# EasyEDA Pro project EFT_X003_Y003_X007_2.eprj

# Schematic Schematic1
Create Date: 2023-04-26; Page Name: P1; Project Name: EFT_X003_Y003_X007_2; Schematic Name: Schematic1; Update Date: 2023-05-25; Company: 嘉立创EDA; Page Size: A4; Version: V1.0
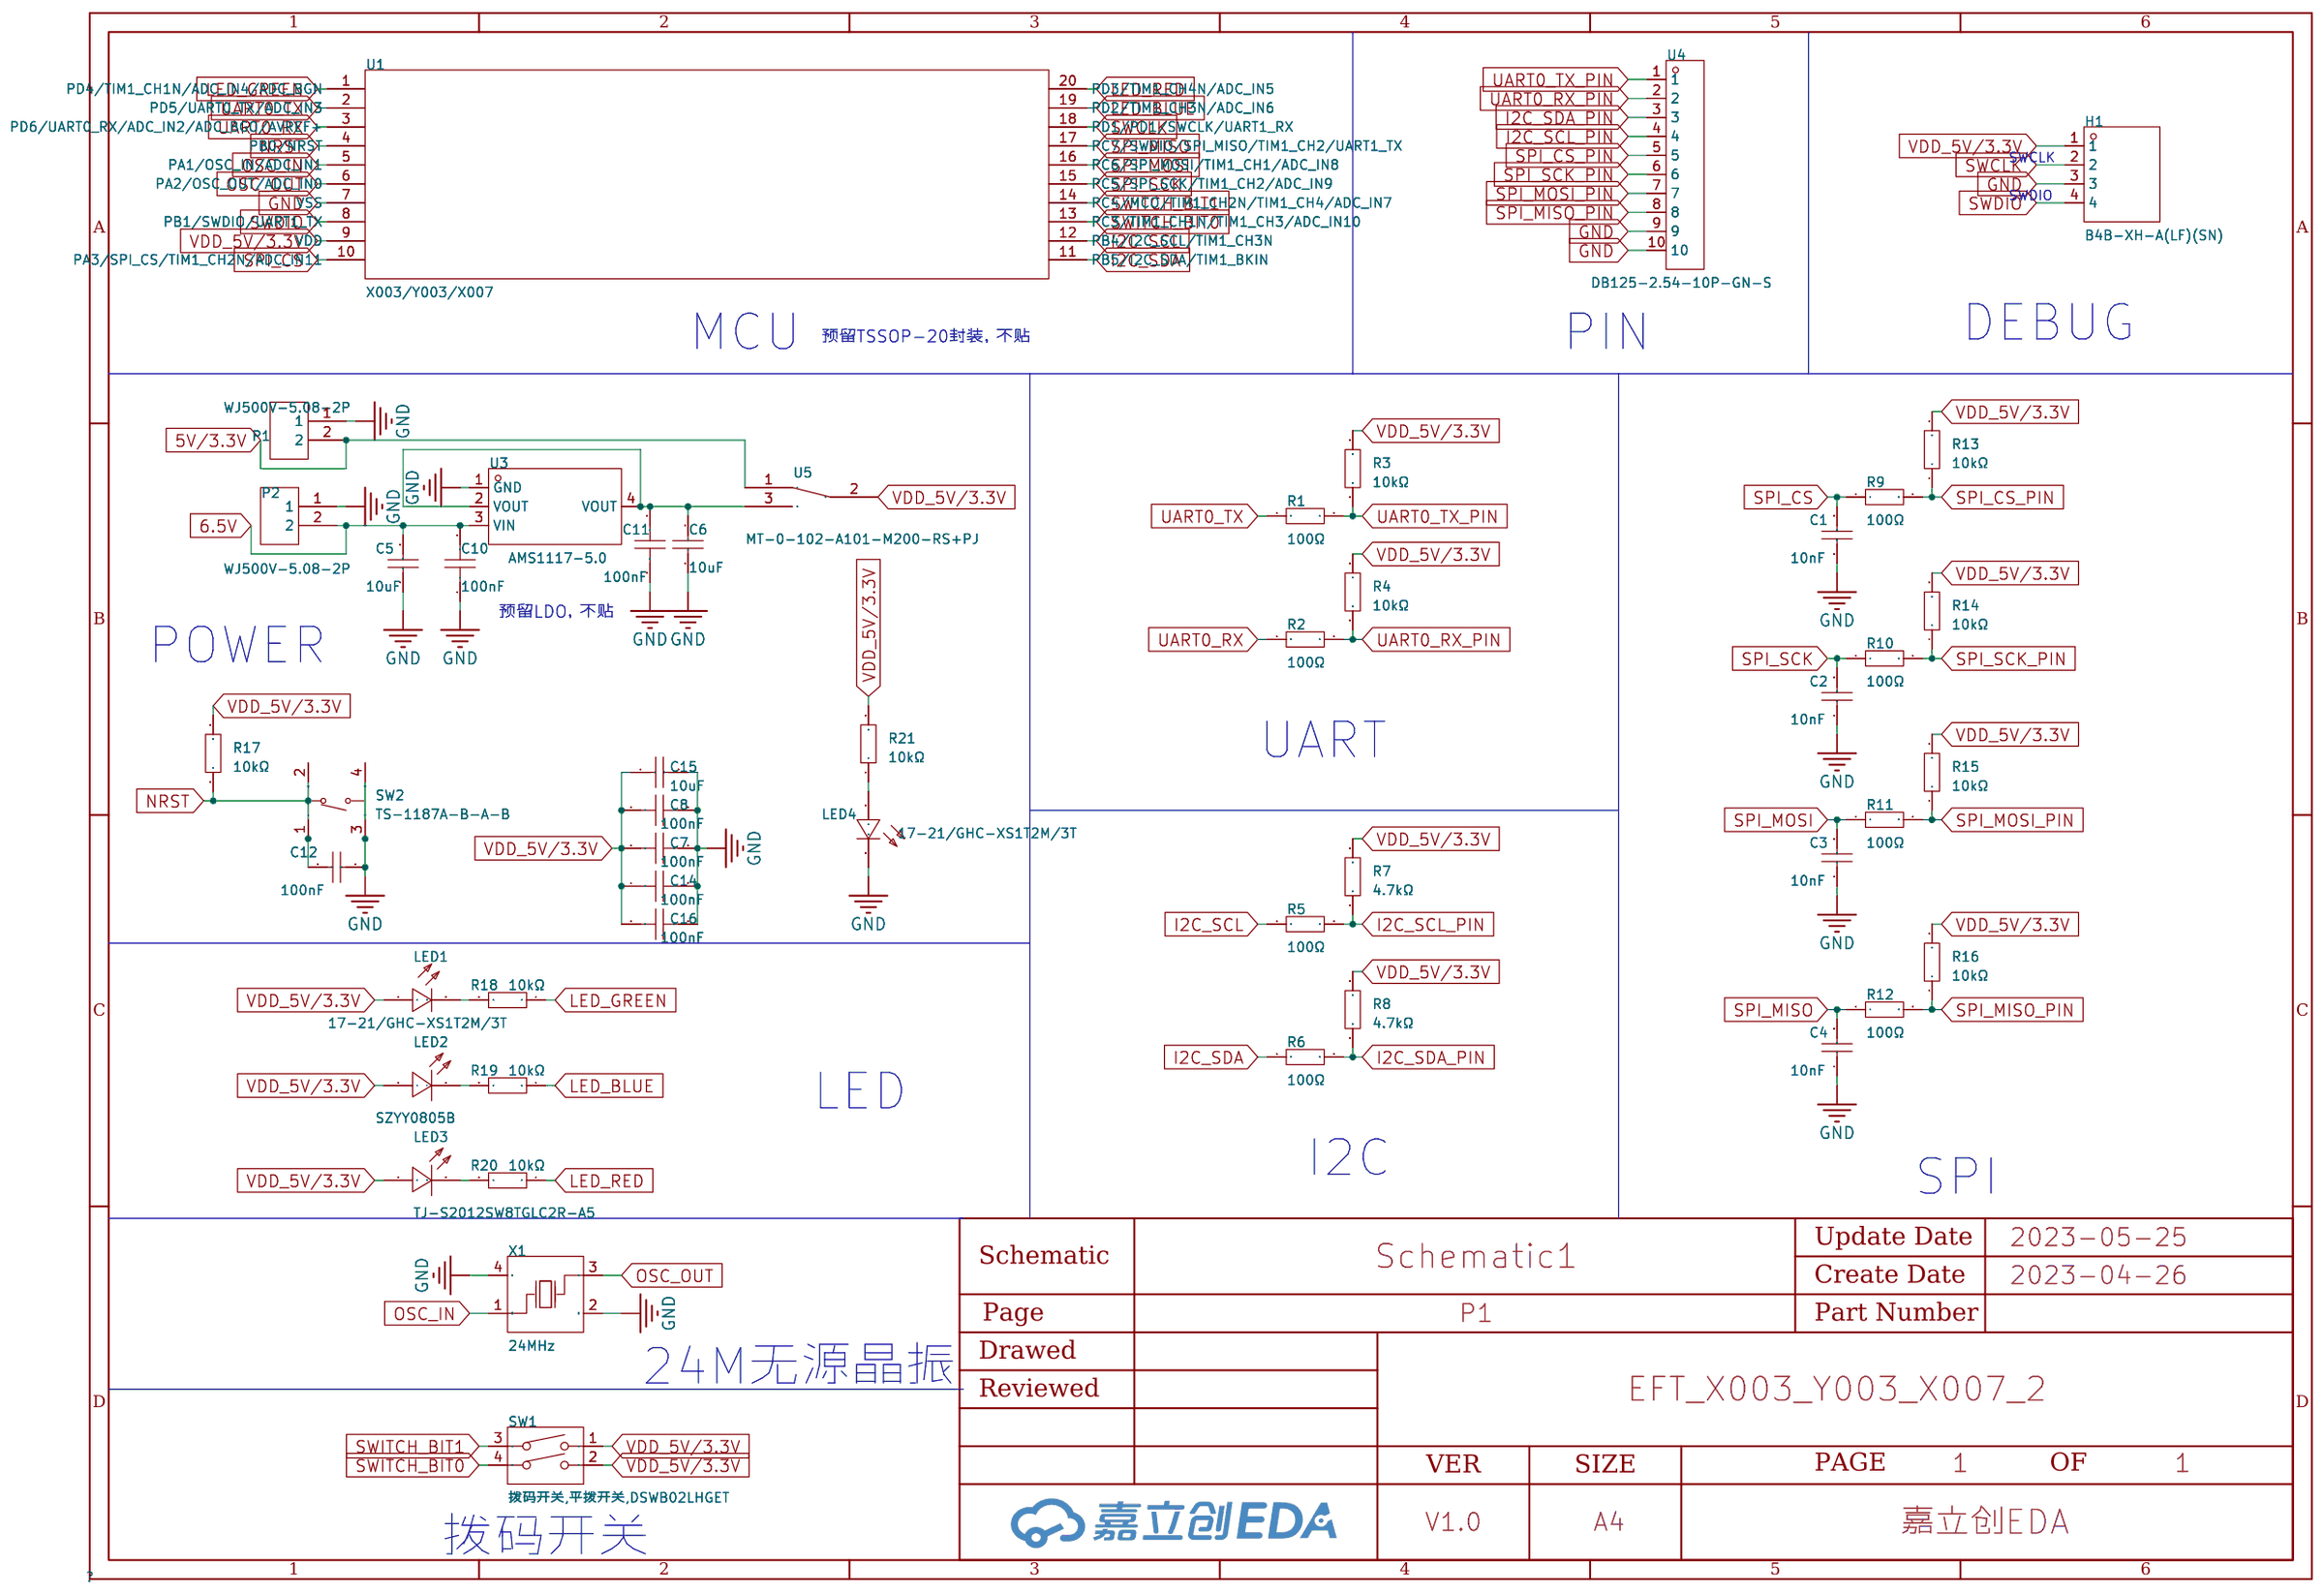
[diagram p0: schematic sheet]

## Parts
C1  10nF  [C0805]
C2  10nF  [C0805]
C3  10nF  [C0805]
C4  10nF  [C0805]
C5  10uF  [C0805]
C6  10uF  [C0805]
C7  100nF  [C0603]
C8  100nF  [C0603]
C10  100nF  [C0603]
C11  100nF  [C0603]
C12  100nF  [C0603]
C14  100nF  [C0603]
C15  10uF  [C0805]
C16  100nF  [C0603]
H1  B4B-XH-A(LF)(SN)  [CONN-TH_B4B-XH-A-LF-SN]
LED1  17-21/GHC-XS1T2M/3T  [LED0805-R-RD]
LED2  SZYY0805B  [LED0805-R-RD_BLUE]
LED3  TJ-S2012SW8TGLC2R-A5  [LED0805-R-RD]
LED4  17-21/GHC-XS1T2M/3T  [LED0805-R-RD]
P1  WJ500V-5.08-2P  [CONN-TH_2P-P5.00_WJ500V-5.08-2P]
P2  WJ500V-5.08-2P  [CONN-TH_2P-P5.00_WJ500V-5.08-2P]
R1  100Ω  [R0805]
R2  100Ω  [R0805]
R3  10kΩ  [R0805]
R4  10kΩ  [R0805]
R5  100Ω  [R0805]
R6  100Ω  [R0805]
R7  4.7kΩ  [R0805]
R8  4.7kΩ  [R0805]
R9  100Ω  [R0805]
R10  100Ω  [R0805]
R11  100Ω  [R0805]
R12  100Ω  [R0805]
R13  10kΩ  [R0805]
R14  10kΩ  [R0805]
R15  10kΩ  [R0805]
R16  10kΩ  [R0805]
R17  10kΩ  [R0805]
R18  10kΩ  [R0805]
R19  10kΩ  [R0805]
R20  10kΩ  [R0805]
R21  10kΩ  [R0805]
SW1  拨码开关,平拨开关,DSWB02LHGET  [SW-TH_DSWB02LHGET]
SW2  TS-1187A-B-A-B  [SW-SMD_4P-L5.1-W5.1-P3.70-LS6.5-TL-2]
U1  X003/Y003/X007  [TSSOP-20_L6.5-W4.4-P0.65-LS6.4-BL]
U3  AMS1117-5.0  [SOT-223_L6.5-W3.5-P2.30-LS7.0-BR]
U4  DB125-2.54-10P-GN-S  [CONN-TH_DB125-2.54-10P-GN]
U5  MT-0-102-A101-M200-RS+PJ  [SW-TH_MT-0-103-A101-M200-RS]
X1  24MHz  [CRYSTAL-SMD_4P-L3.2-W2.5-BL]

## Library data of the parts
C1-C4 = CL21B103KBANNNC: 容值:10nF;精度:±10%;额定电压:50V;材质(温度系数):X7R;; LCSC Part Name: 10nF ±10% 50V; Supplier Part: C1710; Manufacturer: SAMSUNG(三星); Supplier Footprint: 0805; JLCPCB Part Class: Basic Part; Datasheet: https://atta.szlcsc.com/upload/public/pdf/source/20160103/1457707693082.pdf; Supplier: LCSC; Tolerance: ±10%; Voltage Rated: 50V; Temperature Coefficient: X7R
C5 C6 C15 = CL21A106KAYNNNE_C15850: 容值:10uF;精度:±10%;额定电压:25V;材质(温度系数):X5R;; LCSC Part Name: 10uF ±10% 25V; Supplier Part: C15850; Manufacturer: SAMSUNG(三星); Manufacturer Part: CL21A106KAYNNNE; Supplier Footprint: 0805; JLCPCB Part Class: Basic Part; Datasheet: https://atta.szlcsc.com/upload/public/pdf/source/20160103/1457707679302.pdf; Supplier: LCSC; Tolerance: ±10%; Voltage Rated: 25V; Temperature Coefficient: X5R
C7 C8 C14 C16 = CC0603KRX7R9BB104: 容值:100nF;精度:±10%;额定电压:50V;材质(温度系数):X7R;; LCSC Part Name: 100nF ±10% 50V; Supplier Part: C14663; Manufacturer: YAGEO(国巨); Supplier Footprint: 0603; JLCPCB Part Class: Basic Part; Datasheet: https://atta.szlcsc.com/upload/public/pdf/source/20180910/C282072_33301C7F631E79921B82A8DAC6BCC5B3.pdf; Supplier: LCSC; Tolerance: ±10%; Voltage Rated: 50V; Temperature Coefficient: X7R
C10 C11 = CL10B104KB8NNNC: 容值:100nF;精度:±10%;额定电压:50V;材质(温度系数):X7R;; LCSC Part Name: 100nF ±10% 50V; Supplier Part: C1591; Manufacturer: SAMSUNG(三星); Supplier Footprint: 0603; JLCPCB Part Class: Extended Part; Datasheet: https://atta.szlcsc.com/upload/public/pdf/source/20160103/1457707680512.pdf; Supplier: LCSC; Tolerance: ±10%; Voltage Rated: 50V; Temperature Coefficient: X7R
C12 = 0603B104K500NT: 容值:100nF;精度:±10%;额定电压:50V;材质(温度系数):X7R;; LCSC Part Name: 100nF ±10% 50V; Supplier Part: C30926; Manufacturer: FH(风华); Supplier Footprint: 0603; JLCPCB Part Class: Extended Part; Datasheet: https://atta.szlcsc.com/upload/public/pdf/source/20170923/C30926_1506149436298988724.pdf; Supplier: LCSC; Tolerance: ±10%; Voltage Rated: 50V; Temperature Coefficient: X7R
H1 = B4B-XH-A(LF)(SN): 参考系列:XH;间距:2.5mm;插针结构:1x4P;排数:1;每排PIN数:4;行距:-;安装方式:-;触头材质:黄铜;; LCSC Part Name: XH 2.5mm 1x4P; Supplier Part: C144395; Manufacturer: JST; Supplier Footprint: 插件,P=2.5mm; JLCPCB Part Class: Extended Part; Datasheet: https://atta.szlcsc.com/upload/public/pdf/source/20180327/C144395_D58F0D17A3F58B29FECD1B7D0A791262.pdf; Supplier: LCSC; Reference Series: XH; Pitch: 2.5mm; Pins Structure: 1x4P; Number of Rows: 1; Number of PINs Per Row: 4; Contact Material: 黄铜
LED1 LED4 = 17-21/GHC-XS1T2M/3T: 发光颜色:翠绿;二极管配置:-;主波长:515nm~530nm;色温:-;功率:75mW;安装方式:-;; LCSC Part Name: 翠绿; Supplier Part: C63855; Manufacturer: EVERLIGHT(亿光); Supplier Footprint: 0805; JLCPCB Part Class: Extended Part; Datasheet: https://atta.szlcsc.com/upload/public/pdf/source/20151222/1457707652176.pdf; Supplier: LCSC; Emitted Color: 翠绿; Lens Color: 无色透明; Dominant Wavelength: 515nm~530nm; Peak Wavelength: 518nm; Forward Current: 20mA; Power Dissipation: 75mW; Viewing Angle: 140°; Operating Temperature: -40℃~+85℃
LED2 = SZYY0805B: 发光颜色:蓝灯;二极管配置:-;主波长:460nm~475nm;色温:-;功率:100mW;安装方式:-;; LCSC Part Name: 蓝灯; Supplier Part: C434433; Manufacturer: yongyu(永裕光电); Supplier Footprint: 0805; JLCPCB Part Class: Extended Part; Datasheet: https://atta.szlcsc.com/upload/public/pdf/source/20191204/C434433_0B90CAB876449C52BDD12D5E48F83BBD.pdf; Supplier: LCSC; Emitted Color: 蓝灯; Lens Color: 无色透明; Dominant Wavelength: 460nm~475nm; Peak Wavelength: 469nm; Forward Current: 5mA; Power Dissipation: 100mW; Viewing Angle: 120°; Operating Temperature: -40℃~+85℃
LED3 = TJ-S2012SW8TGLC2R-A5: 发光颜色:红灯;二极管配置:-;主波长:620nm;色温:-;功率:72mW;安装方式:-;; LCSC Part Name: 红灯; Supplier Part: C192318; Manufacturer: TOGIALED(统佳); Supplier Footprint: 0805; JLCPCB Part Class: Extended Part; Datasheet: https://atta.szlcsc.com/upload/public/pdf/source/20180531/C192318_B0850358C40B41819ED2D84BD318C419.pdf; Supplier: LCSC; Emitted Color: 红灯; Lens Color: 无色透明; Dominant Wavelength: 620nm; Peak Wavelength: 635nm; Forward Current: 20mA; Power Dissipation: 72mW; Viewing Angle: 120°; Operating Temperature: -40℃~+80℃
P1 P2 = WJ500V-5.08-2P: 间距:5.08mm;结构:1x2P;排数:1;每排PIN数:2;安装方式:直针;额定电流:18A;额定电压:250V;线规 - AWG:14~30;线规 - mm2:2.5;工作温度范围:-40℃~+105℃;颜色:绿色;; LCSC Part Name: 5.08mm 1x2P 排数:1 每排P数:2 直针 可拼接; Supplier Part: C8465; Manufacturer: KANGNEX(康奈克斯电气); Supplier Footprint: 插件,P=5.08mm; JLCPCB Part Class: Extended Part; Datasheet: https://atta.szlcsc.com/upload/public/pdf/source/20191225/C8465_02D34CE5B5B4A53DF5891601D97FA9F4.pdf; Supplier: LCSC; Pitch: 5.08mm; Structure: 1x2P; Number of Rows: 1; Number of PINs Per Row: 2; Mounting Style: 直针; Current Rating (Max): 18A; Voltage Rating (Max): 250V; Wire Gauge - AWG: 14~30; Wire Gauge - mm2: 2.5; Operating Temperature Range: -40℃~+105℃; Color: 绿色
R1 R2 R5 R6 R9-R12 = 0805W8F1000T5E: 电阻类型:厚膜电阻;阻值:100Ω;精度:±1%;功率:125mW;; LCSC Part Name: 100Ω ±1% 125mW; Supplier Part: C17408; Manufacturer: UNI-ROYAL(厚声); Supplier Footprint: 0805; JLCPCB Part Class: Basic Part; Datasheet: https://atta.szlcsc.com/upload/public/pdf/source/20200306/C422600_1E6D84923E4A46A82E41ADD87F860B5C.pdf; Supplier: LCSC; Type: 厚膜电阻; Tolerance: ±1%; Power(Watts): 125mW; Temperature Coefficient: ±100ppm/℃; Overload Voltage (Max): 150V; Operating Temperature Range: -55℃~+155℃
R3 R4 R13-R16 = 0805W8F1002T5E_C17414: 电阻类型:厚膜电阻;阻值:10kΩ;精度:±1%;功率:125mW;; LCSC Part Name: 10kΩ ±1% 125mW; Supplier Part: C17414; Manufacturer: UNI-ROYAL(厚声); Manufacturer Part: 0805W8F1002T5E; Supplier Footprint: 0805; JLCPCB Part Class: Basic Part; Datasheet: https://atta.szlcsc.com/upload/public/pdf/source/20200306/C422600_1E6D84923E4A46A82E41ADD87F860B5C.pdf; Supplier: LCSC; Type: 厚膜电阻; Tolerance: ±1%; Power(Watts): 125mW; Temperature Coefficient: ±100ppm/℃; Overload Voltage (Max): 150V; Operating Temperature Range: -55℃~+155℃
R7 R8 = 0805W8F4701T5E: 电阻类型:厚膜电阻;阻值:4.7kΩ;精度:±1%;功率:125mW;; LCSC Part Name: 4.7kΩ ±1% 125mW; Supplier Part: C17673; Manufacturer: UNI-ROYAL(厚声); Supplier Footprint: 0805; JLCPCB Part Class: Basic Part; Datasheet: https://atta.szlcsc.com/upload/public/pdf/source/20200306/C422600_1E6D84923E4A46A82E41ADD87F860B5C.pdf; Supplier: LCSC; Type: 厚膜电阻; Tolerance: ±1%; Power(Watts): 125mW; Temperature Coefficient: ±100ppm/℃; Overload Voltage (Max): 150V; Operating Temperature Range: -55℃~+155℃
R17-R21 = RC0805FR-0710KL: 阻值:10kΩ;精度:±1%;功率:125mW;温度系数:±100ppm/℃;最大工作电压:150V;工作温度范围:-55℃~+155℃;; LCSC Part Name: 10kΩ ±1% 125mW; Supplier Part: C84376; Manufacturer: YAGEO(国巨); Supplier Footprint: 0805; JLCPCB Part Class: Extended Part; Datasheet: https://atta.szlcsc.com/upload/public/pdf/source/20170412/1491969112878.pdf; Supplier: LCSC; Tolerance: ±1%; Power(Watts): 125mW; Temperature Coefficient: ±100ppm/℃; Overload Voltage (Max): 150V; Operating Temperature Range: -55℃~+155℃
SW1 = 拨码开关,平拨开关,DSWB02LHGET: 类型:平拨，凸起式;电路结构:单刀单掷;开关位数:2;引脚间距:2.54mm;颜色:红色;; Supplier Part: C99421; Manufacturer: YE; Supplier Footprint: 插件; JLCPCB Part Class: Extended Part; Datasheet: https://atta.szlcsc.com/upload/public/pdf/source/20170330/1490854270511.pdf; Supplier: LCSC; Type: 平拨，凸起式; Circuit: 单刀单掷; Number of Positions: 2; Lead Pitch: 2.54mm; Color: 红色
SW2 = TS-1187A-B-A-B: 触点电流:50mA;额定电压(DC):12V;绝缘电阻:-;电路结构:单刀单掷;安装方式:立贴;带灯:无;作用力:160gf;机械寿命:10万次;带支架:否;; LCSC Part Name: 5.1*5.1*1.5mm 立贴 轻触开关 防水金属头; Supplier Part: C318884; Manufacturer: XKB Connectivity(中国星坤); Supplier Footprint: SMD; JLCPCB Part Class: Basic Part; Datasheet: https://atta.szlcsc.com/upload/public/pdf/source/20200227/C318884_1F20165719E1C4CAA3E10C4C359C6E26.pdf; Supplier: LCSC; Contact Current: 50mA; Voltage Rating (DC): 12V; Circuit: 单刀单掷; Mounting Style: 立贴; Actuator Style: 圆形按钮; Actuator/Cap Color: 金色; With Lamp: 无; Operating Force: 160gf; Mechanical Life: 10万次; Operating Temperature: -30℃~+85℃; Switch Length: 5.1mm; Switch Width: 5.1mm; Switch Height: 1.5mm; Strike Gundam: 否
U1 = PT32Y003
U3 = AMS1117-5.0_C6187: 输出类型:固定;输出极性:正;最大输入电压:15V;输出电压:5V;输出电流:1A;电源纹波抑制比(PSRR):68dB@(120Hz);; Supplier Part: C6187; Manufacturer: AMS; Supplier Footprint: SOT-223; JLCPCB Part Class: Basic Part; Datasheet: https://atta.szlcsc.com/upload/public/pdf/source/20180727/C6186_7A095716F0823C02F1997A905E26C086.pdf; Supplier: LCSC; Output Type: 固定; Output Polarity: 正; Number of Outputs: 1; Maximum Input Voltage: 15V; Output Voltage: 5V; Dropout Voltage: 1.3V@(1A); Output Current: 1A; Power Supply Rejection Ratio (PSRR): 68dB@(120Hz)
U4 = DB125-2.54-10P-GN-S: 间距:2.54mm;结构:1x10P;排数:1;每排PIN数:10;安装方式:直针;额定电流:8A;额定电压:130V;线规 - AWG:18~26;线规 - mm2:0.5~1;工作温度范围:-40℃~+105℃;颜色:绿色;; LCSC Part Name: 2.54mm 1x10P 排数:1 每排P数:10 直针; Supplier Part: C918128; Manufacturer: DIBO(地博电气); Supplier Footprint: 插件,P=2.54mm; JLCPCB Part Class: Extended Part; Datasheet: https://atta.szlcsc.com/upload/public/pdf/source/20230106/BCD3A0BE1EB95DC3E813F1745F022035.pdf; Supplier: LCSC; Pitch: 2.54mm; Structure: 1x10P; Number of Rows: 1; Number of PINs Per Row: 10; Mounting Style: 直针; Current Rating (Max): 8A; Voltage Rating (Max): 130V; Wire Gauge - AWG: 18~26; Wire Gauge - mm2: 0.5~1; Operating Temperature Range: -40℃~+105℃; Color: 绿色
U5 = MT-0-102-A101-M200-RS+PJ: 额定电流:5A;额定电压(AC):125V;电路结构:单刀双掷;机械寿命:-;安装方式:直插;; LCSC Part Name: 小型钮子三脚二档(五件套); Supplier Part: C1788492; Manufacturer: YUEN FUNG(源丰); Supplier Footprint: 插件; JLCPCB Part Class: Extended Part; Datasheet: https://atta.szlcsc.com/upload/public/pdf/source/20201225/C1788492_A57BE75F5111615E295075D92E39ECB7.pdf; Supplier: LCSC; Contact Current: 5A; Voltage Rating (AC): 125V; Circuit: 单刀双掷; Actuator Type: 圆柱钮柄; Pin Style: 焊片; Mounting Style: 直插; Operating Temperature: -25℃~+85℃; Switch Length: 13mm; Switch Width: 8mm; Switch Height: 28.6mm
X1 = 3S24000333: 频率:24MHz;频率公差:±10ppm;频率稳定度:±50ppm;负载电容:8pF;; LCSC Part Name: 24MHz ±10ppm 8pF; Supplier Part: C427553; Manufacturer: YL(惠伦晶体); Supplier Footprint: SMD3225-4P; JLCPCB Part Class: Extended Part; Datasheet: https://atta.szlcsc.com/upload/public/pdf/source/20190911/C427553_A09B0D9076107BB8EFDFC7C7D2192982.pdf; Supplier: LCSC; Crystal Type: 贴片无源晶振; Frequency Tolerance: ±10ppm; Frequency Stability: ±50ppm; Load Capacitance: 8pF; Equivalent Series Resistance (ESR): 50Ω; Operating Temperature: -40℃~+125℃

## Nets
5V/3.3V: P1.2 U5.1
6.5V: C5.2 C10.2 P2.2 U3.3(VIN)
GND: C1.1 C2.1 C3.1 C4.1 C5.1 C6.1 C7.2 C8.2 C10.1 C11.1 C12.2 C14.2 C15.2 C16.2 H1.3 LED4.2(C) P1.1 P2.1 SW2.3(C) SW2.4(D) U1.7(VSS) U3.1(GND) U4.9 U4.10 X1.2(GND) X1.4(GND)
VDD_5V/3.3V: C7.1 C8.1 C14.1 C15.1 C16.1 H1.1 LED1.1(A) LED2.1(+) LED3.1(A) R3.2 R4.1 R7.2 R8.2 R13.2 R14.2 R15.2 R16.2 R17.2 R21.2 SW1.1 SW1.2 U1.9(VDD) U5.2
I2C_SCL: R5.1 U1.12(PB4/I2C_SCL/TIM1_CH3N)
I2C_SCL_PIN: R5.2 R7.1 U4.4
I2C_SDA: R6.1 U1.11(PB5/I2C_SDA/TIM1_BKIN)
I2C_SDA_PIN: R6.2 R8.1 U4.3
LED_BLUE: R19.1 U1.19(PD2/TIM1_CH3N/ADC_IN6)
LED_GREEN: R18.1 U1.1(PD4/TIM1_CH1N/ADC_IN4/ADC_BGN)
LED_RED: R20.1 U1.20(PD3/TIM1_CH4N/ADC_IN5)
NRST: C12.1 R17.1 SW2.1(A) SW2.2(B) U1.4(PB0/NRST)
OSC_IN: U1.5(PA1/OSC_IN/ADC_IN1) X1.1(OSC1)
OSC_OUT: U1.6(PA2/OSC_OUT/ADC_IN0) X1.3(OSC2)
SPI_CS: C1.2 R9.1 U1.10(PA3/SPI_CS/TIM1_CH2N/ADC_IN11)
SPI_CS_PIN: R9.2 R13.1 U4.5
SPI_MISO: C4.2 R12.1 U1.17(PC7/SWDIO/SPI_MISO/TIM1_CH2/UART1_TX)
SPI_MISO_PIN: R12.2 R16.1 U4.8
SPI_MOSI: C3.2 R11.1 U1.16(PC6/SPI_MOSI/TIM1_CH1/ADC_IN8)
SPI_MOSI_PIN: R11.2 R15.1 U4.7
SPI_SCK: C2.2 R10.1 U1.15(PC5/SPI_SCK/TIM1_CH2/ADC_IN9)
SPI_SCK_PIN: R10.2 R14.1 U4.6
SWCLK: H1.2 U1.18(PD1/PD1/SWCLK/UART1_RX)
SWDIO: H1.4 U1.8(PB1/SWDIO/UART1_TX)
SWITCH_BIT0: SW1.4 U1.13(PC3/TIM1_CH1N/TIM1_CH3/ADC_IN10)
SWITCH_BIT1: SW1.3 U1.14(PC4/MCO/TIM1_CH2N/TIM1_CH4/ADC_IN7)
UART0_RX: R2.1 U1.3(PD6/UART0_RX/ADC_IN2/ADC_BGO/AVREF+)
UART0_RX_PIN: R2.2 R4.2 U4.2
UART0_TX: R1.1 U1.2(PD5/UART0_TX/ADC_IN3)
UART0_TX_PIN: R1.2 R3.1 U4.1
$1N2907: LED4.1(A) R21.1
$1N5214: LED1.2(C) R18.2
$1N5236: LED3.2(C) R20.2
$1N5790: LED2.2(-) R19.2
$1N14977: C6.2 C11.2 U3.2(VOUT) U3.4(VOUT) U5.3

## Notes on the sheet
- SWCLK
- SWDIO
- MCU
- 预留TSSOP-20封装，不贴
- PIN
- DEBUG
- 预留LDO，不贴
- POWER
- UART
- LED
- I2C
- SPI
- 24M无源晶振
- 拨码开关

# Board PCB1
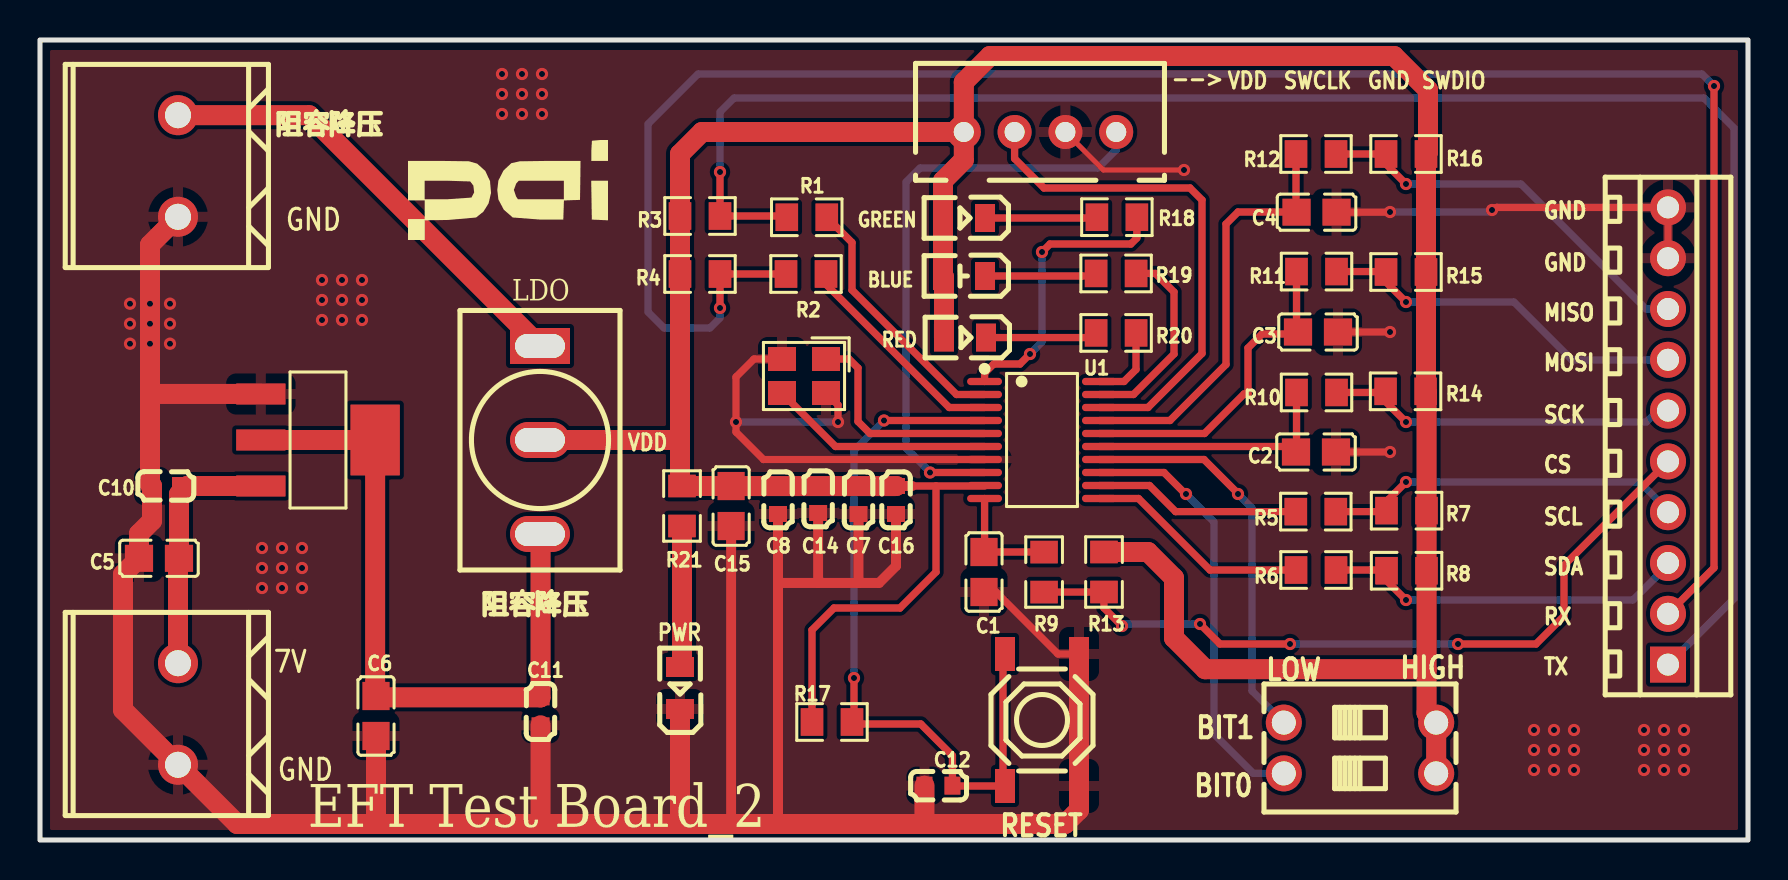
[diagram p1: board, top side]
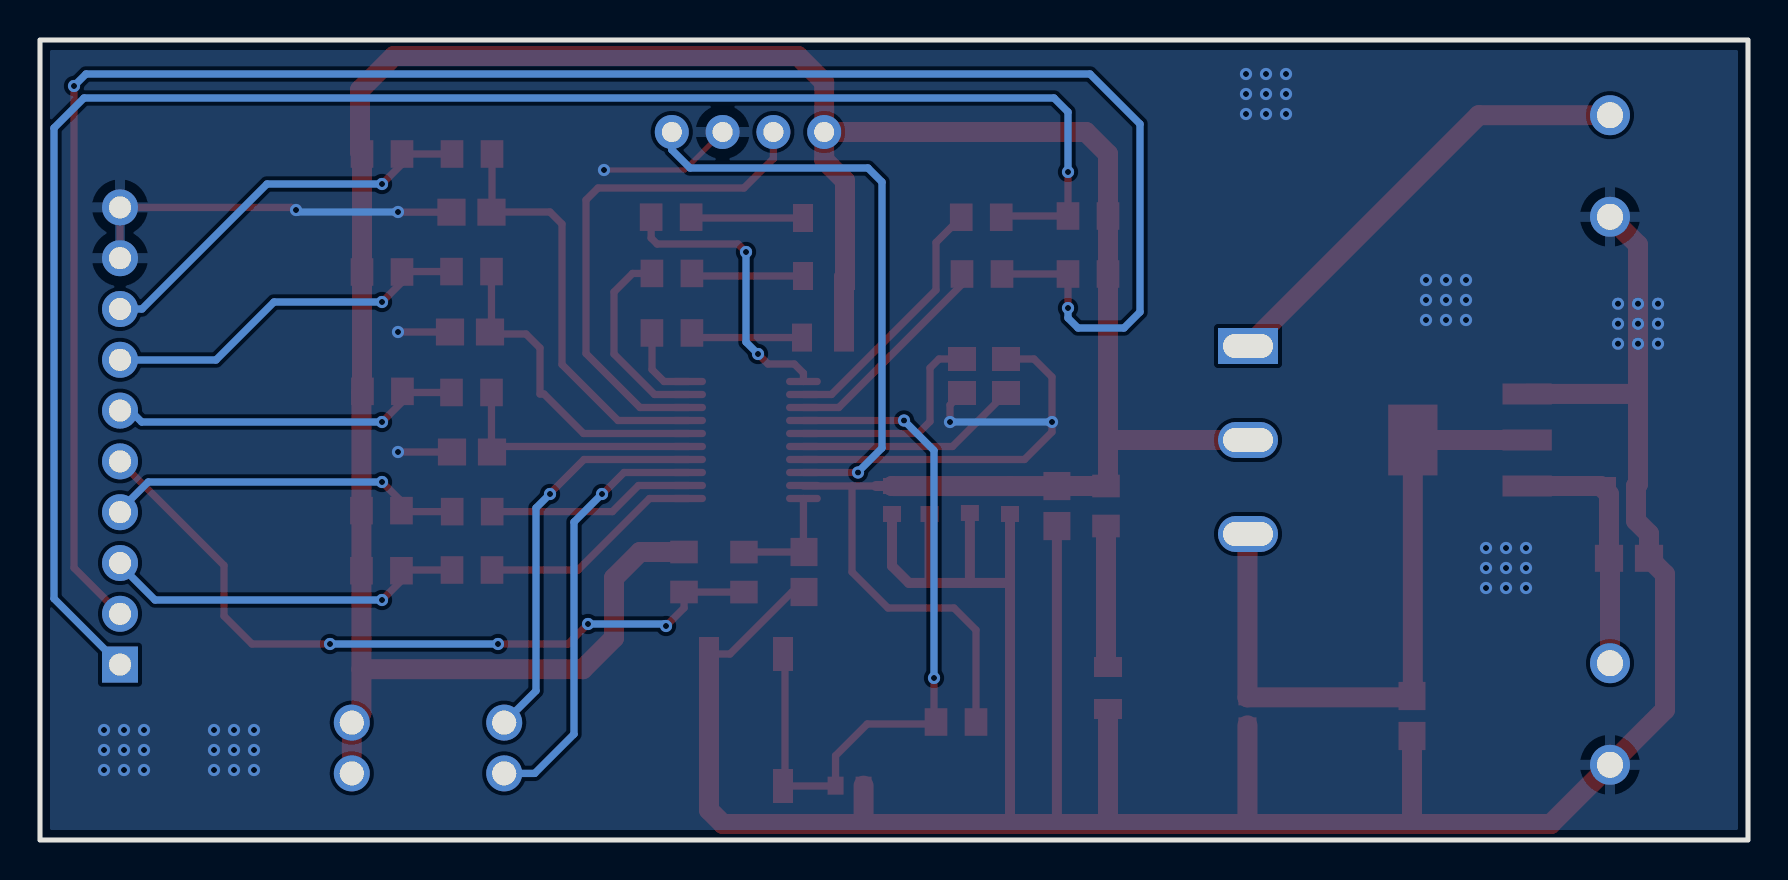
[diagram p2: board, bottom side, seen from below]

Outline 85.4 x 40 mm; copper layers: Top Layer, Bottom Layer. Coordinates in mm from the lower left corner of the outline.
Outline path: rectangle 0,40 85.4,0
Stack: Top Layer 0.035mm / Dielectric1 1.51mm FR4 er 4.5 / Bottom Layer 0.035mm

## Design rules (mm)
template: 自定义配置
spacing copperThickness1oz (default): track to track 0.102, other pairs 0.152 to 0.3
spacing copperThickness2oz: track to track 0.5, other pairs 0.152 to 0.3
track width copperThickness1oz (default): min 0.127, default 0.254, max 2.54
track width copperThickness2oz: min 0.203, default 0.254, max 2.54
differential pair differentialPair (default): width min 0.127, default 0.254, max 2.54; gap min 0.152, default 0.152
via viaSize (default): diameter min 0.5, default 0.61, max 10; hole min 0.3, default 0.305, max 6.3
['net', 'vdd 5v/3.3v'] ['NET', 'GND'] uses copperThickness2oz
['net', 'vdd 5v/3.3v'] ['NET', 'GND'] uses copperRegion1
['net', '5v/3.3v'] ['NET', 'GND'] uses copperRegion1
['net', '6.5v'] ['NET', 'GND'] uses copperRegion1
['net', '$1n2907'] ['NET', 'GND'] uses copperRegion1
['net', '$1n14977'] ['NET', 'GND'] uses copperRegion1

## Placement (name value [footprint] x y rotation side)
C1  10nF  [C0805]  47.2 13.4 90 top
C2  10nF  [C0805]  63.8 19.4 180 top
C3  10nF  [C0805]  63.9 25.4 180 top
C4  10nF  [C0805]  63.83 31.39 180 top
C5  10uF  [C0805]  5.95 14.09 0 top
C6  10uF  [C0805]  16.8 6.2 90 top
C7  100nF  [C0603]  40.93 17 270 top
C8  100nF  [C0603]  36.9 17 270 top
C10  100nF  [C0603]  6.3 17.7 0 top
C11  100nF  [C0603]  25.03 6.43 90 top
C12  100nF  [C0603]  44.92 2.72 180 top
C14  100nF  [C0603]  38.91 17.05 270 top
C15  10uF  [C0805]  34.56 16.7 270 top
C16  100nF  [C0603]  42.8 17 270 top
H1  B4B-XH-A(LF)(SN)  [CONN-TH_B4B-XH-A-LF-SN]  50 35.4 0 top
LED1  17-21/GHC-XS1T2M/3T  [LED0805-R-RD]  46.2 31.1 180 top
LED2  SZYY0805B  [LED0805-R-RD_BLUE]  46.2 28.2 180 top
LED3  TJ-S2012SW8TGLC2R-A5  [LED0805-R-RD]  46.25 25.12 180 top
LED4  17-21/GHC-XS1T2M/3T  [LED0805-R-RD]  32 7.6 90 top
P1  WJ500V-5.08-2P  [CONN-TH_2P-P5.00_WJ500V-5.08-2P]  6.9 33.7 90 top
P2  WJ500V-5.08-2P  [CONN-TH_2P-P5.00_WJ500V-5.08-2P]  6.9 6.3 90 top
R1  100Ω  [R0805]  38.34 31.14 180 top
R2  100Ω  [R0805]  38.3 28.3 180 top
R3  10kΩ  [R0805]  33 31.2 180 top
R4  10kΩ  [R0805]  33 28.3 0 top
R5  100Ω  [R0805]  63.79 16.42 0 top
R6  100Ω  [R0805]  63.8 13.5 0 top
R7  4.7kΩ  [R0805]  68.33 16.47 0 top
R8  4.7kΩ  [R0805]  68.33 13.46 0 top
R9  100Ω  [R0805]  50.2 13.4 270 top
R10  100Ω  [R0805]  63.83 22.38 0 top
R11  100Ω  [R0805]  63.83 28.42 0 top
R12  100Ω  [R0805]  63.8 34.3 0 top
R13  10kΩ  [R0805]  53.2 13.4 90 top
R14  10kΩ  [R0805]  68.28 22.43 0 top
R15  10kΩ  [R0805]  68.3 28.4 0 top
R16  10kΩ  [R0805]  68.3 34.3 0 top
R17  10kΩ  [R0805]  39.6 5.9 180 top
R18  10kΩ  [R0805]  53.84 31.14 180 top
R19  10kΩ  [R0805]  53.8 28.33 180 top
R20  10kΩ  [R0805]  53.8 25.35 180 top
R21  10kΩ  [R0805]  32.1 16.7 90 top
SW1  拨码开关,平拨开关,DSWB02LHGET  [SW-TH_DSWB02LHGET]  66 4.6 270 top
SW2  TS-1187A-B-A-B  [SW-SMD_4P-L5.1-W5.1-P3.70-LS6.5-TL-2]  50.1 6 90 top
U1  X003/Y003/X007  [TSSOP-20_L6.5-W4.4-P0.65-LS6.4-BL]  50.1 20 270 top
U3  AMS1117-5.0  [SOT-223_L6.5-W3.5-P2.30-LS7.0-BR]  13.9 20 180 top
U4  DB125-2.54-10P-GN-S  [CONN-TH_DB125-2.54-10P-GN]  81.4 20.2 90 top
U5  MT-0-102-A101-M200-RS+PJ  [SW-TH_MT-0-103-A101-M200-RS]  25 20 270 top
X1  24MHz  [CRYSTAL-SMD_4P-L3.2-W2.5-BL]  38.2 23.2 180 top

## Footprints (pads in the part's own frame, mm; a bottom-side part is the same pattern mirrored in y, then rotated)
C0603
  rect 0.8x0.9 smd: 1(-0.7,0) 2(0.7,0)
C0805
  rect 1.41x1.35 smd: 1(-1,0) 2(1,0)
CONN-TH_2P-P5.00_WJ500V-5.08-2P
  round 2 hole 1.3: 1(-2.54,0) 2(2.54,0)
CONN-TH_B4B-XH-A-LF-SN
  round 1.7 hole 1: 1(-3.81,0) 2(-1.27,0) 3(1.27,0) 4(3.81,0)
CONN-TH_DB125-2.54-10P-GN
  rect 1.8x1.8 hole 1.1: 1(-11.43,0)
  round 1.8 hole 1.1: 2(-8.89,0) 3(-6.35,0) 4(-3.81,0) 5(-1.27,0) 6(1.27,0) 7(3.81,0) 8(6.35,0) 9(8.89,0) 10(11.43,0)
CRYSTAL-SMD_4P-L3.2-W2.5-BL
  rect 1.4x1.2 smd: 1(-1.1,-0.85) 2(1.1,-0.85) 3(1.1,0.85) 4(-1.1,0.85)
LED0805-R-RD
  rect 1x1.399 smd: 1(1.05,0) 2(-1.05,0)
LED0805-R-RD_BLUE
  rect 1x1.399 smd: 1(1.05,0) 2(-1.05,0)
R0805
  rect 1.133x1.377 smd: 1(-1,0) 2(1,0)
SOT-223_L6.5-W3.5-P2.30-LS7.0-BR
  rect 2.465x1.05 smd: 1(2.857,-2.3) 2(2.857,0) 3(2.857,2.3)
  rect 2.465x3.54 smd: 4(-2.857,0)
SW-SMD_4P-L5.1-W5.1-P3.70-LS6.5-TL-2
  rect 1.7x1 smd: 1(-3.3,1.85) 2(3.3,1.85) 3(-3.3,-1.85) 4(3.3,-1.85)
SW-TH_DSWB02LHGET
  round 1.8 hole 1.2: 1(-1.27,3.81) 2(1.27,3.81) 3(-1.27,-3.81) 4(1.27,-3.81)
SW-TH_MT-0-103-A101-M200-RS
  rect 1.8x3 hole 1.2x2.5: 1(-4.7,0)
  oval 1.8x3 hole 1.2x2.5: 2(0,0) 3(4.7,0)
TSSOP-20_L6.5-W4.4-P0.65-LS6.4-BL
  oval 0.364x1.742 smd: 1(-2.925,-2.871) 2(-2.275,-2.871) 3(-1.625,-2.871) 4(-0.975,-2.871) 5(-0.325,-2.871) 6(0.325,-2.871) 7(0.975,-2.871) 8(1.625,-2.871) 9(2.275,-2.871) 10(2.925,-2.871) 11(2.925,2.871) 12(2.275,2.871) 13(1.625,2.871) 14(0.975,2.871) 15(0.325,2.871) 16(-0.325,2.871) 17(-0.975,2.871) 18(-1.625,2.871) 19(-2.275,2.871) 20(-2.925,2.871)

## Nets
As in the schematic.

## Via types
v1: diameter 0.61, hole 0.305, Top Layer to Bottom Layer, 80 vias

## Routing (per net, layer and track width the routed paths; a pad name or vN(x,y) marks a point on that pad's centre or on a via; arc(x,y) is an arc through that point)
5V/3.3V: length 22.9
  Top Layer w1: U5.1 13.46,36.24 P1.2
6.5V: length 12.7
  Top Layer w1: U3.3 7.36,17.7 6.95,17.29 C5.2 6.9,14.04 P2.2
GND: length 215.8
  Top Layer w0.254: H1.3 53.17,33.5 v1(57.2,33.5)
  Top Layer w0.364: v1(39.9,20.9) 39.9,21.75 X1.4 ; v1(67.5,19.4) C2.1 ; X1.2 35.7,24.05 34.8,23.15 v1(34.8,20.9) 34.8,20.4 36.18,19.03 U1.7 ; C4.1 67.49,31.39 v1(67.5,31.4) ; v1(67.5,25.4) C3.1 ; v1(72.6,31.5) 72.6,31.4 72.83,31.63 U4.10 U4.9 ; SW2.4 50.9,9.3 47.8,12.4 C1.1
  Top Layer w0.5: 36.9,12.85 36.9,0.89 36.81,0.8 ; 36.9,12.85 38.89,12.85 ; 36.9,12.85 C8.2 ; 38.89,12.85 38.91,12.87 C14.2 ; 38.89,12.85 40.92,12.85 ; C7.2 40.93,12.86 40.92,12.85 ; 40.92,12.85 41.95,12.85 42.8,13.7 C16.2 ; C15.2 34.56,0.85 34.5,0.8
  Top Layer w1: 17.01,0.8 16.8,1.01 C6.1 ; 17.01,0.8 25.2,0.8 ; 17.01,0.8 9.86,0.8 P2.1 4.15,6.51 4.15,13.29 C5.1 4.95,15.31 5.6,15.96 C10.1 5.5,17.8 5.5,22.2 ; 32.15,0.8 32,0.95 LED4.2 ; 32.15,0.8 44.18,0.8 ; 32.15,0.8 25.2,0.8 ; 44.18,0.8 51.25,0.8 51.95,1.5 SW2.3 SW2.4 ; 44.18,0.8 44.22,0.84 C12.2 ; 5.5,22.2 5.6,22.3 11.04,22.3 U3.1 ; 5.5,22.2 v1(5.5,24.81) v1(5.5,25.81) v1(5.5,26.81) 5.5,29.76 P1.1 ; C11.1 25.03,0.98 25.2,0.8
  Bottom Layer w0.364: v1(39.9,20.9) v1(34.8,20.9) ; v1(67.5,31.4) 72.5,31.4 v1(72.6,31.5)
  vias: v1(4.5,26.81) v1(4.5,25.81) v1(4.5,24.81) v1(6.5,26.81) v1(6.5,25.81) v1(6.5,24.81) v1(11.1,14.6) v1(11.1,13.6) v1(11.1,12.6) v1(12.1,14.6) v1(12.1,13.6) v1(12.1,12.6) v1(13.1,14.6) v1(13.1,13.6) v1(13.1,12.6) v1(14.1,28) v1(14.1,27) v1(14.1,26) v1(15.1,28) v1(15.1,27) v1(15.1,26) v1(16.1,28) v1(16.1,27) v1(16.1,26) v1(23.1,38.3) v1(23.1,37.3) v1(23.1,36.3) v1(24.1,38.3) v1(24.1,37.3) v1(24.1,36.3) v1(25.1,38.3) v1(25.1,37.3) v1(25.1,36.3) v1(74.7,5.5) v1(74.7,4.5) v1(74.7,3.5) v1(75.7,5.5) v1(75.7,4.5) v1(75.7,3.5) v1(76.7,5.5) v1(76.7,4.5) v1(76.7,3.5) v1(80.2,5.5) v1(80.2,4.5) v1(80.2,3.5) v1(81.2,5.5) v1(81.2,4.5) v1(81.2,3.5) v1(82.2,5.5) v1(82.2,4.5) v1(82.2,3.5)
VDD_5V/3.3V: length 162.1
  Top Layer w0.364: 44.79,17.7 43.6,17.7 ; 44.79,17.7 47.23,17.7 ; 44.79,17.7 44.8,17.69 44.8,13.4 43,11.6 39.7,11.6 38.6,10.5 R17.2
  Top Layer w0.5: 42.82,17.7 43.6,17.7
  Top Layer w1: H1.1 46.19,34 45.15,32.96 LED1.1 LED2.1 45.2,28.15 LED3.1 ; H1.1 46.19,37.89 47.5,39.2 67.7,39.2 69.4,37.5 69.4,34.4 R16.2 R15.2 69.3,22.45 R14.2 69.33,22.38 R7.2 R8.2 69.33,8.54 ; H1.1 33.1,35.4 32,34.3 R3.2 R4.1 32,20.05 ; 32,20.05 31.95,20 U5.2 ; 32,20.05 32,17.8 R21.2 34.55,17.7 C15.1 C7.1 42.8,17.7 C16.1 ; R13.2 55.4,14.4 56.7,13.1 56.7,10.1 58.26,8.54 69.33,8.54 ; 69.33,8.54 69.33,6.35 SW1.1 SW1.2
I2C_SCL: length 10.4
  Top Layer w0.364: R5.1 56.78,16.42 55.47,17.73 U1.12
I2C_SCL_PIN: length 18.2
  Top Layer w0.364: R5.2 67.28,16.42 R7.1 67.4,16.54 67.4,17 v1(68.3,17.9)
  Bottom Layer w0.364: v1(68.3,17.9) 79.99,17.9 81.4,16.49 U4.4
I2C_SDA: length 11.3
  Top Layer w0.364: R6.1 58.5,13.5 54.93,17.08 U1.11
I2C_SDA_PIN: length 18.3
  Top Layer w0.364: R6.2 67.29,13.5 R8.1 67.33,12.97 v1(68.3,12)
  Bottom Layer w0.364: U4.3 81.4,13.75 79.65,12 v1(68.3,12)
LED_BLUE: length 9.9
  Top Layer w0.364: R19.1 55.77,28.33 56.7,27.4 56.7,24.3 54.68,22.28 U1.19
LED_GREEN: length 14.5
  Top Layer w0.364: U1.1 47.23,23.34 47.69,23.8 49,23.8 v1(49.5,24.3) ; v1(50.1,29.4) 50.5,29.8 54.54,29.8 54.84,30.1 R18.1
  Bottom Layer w0.364: v1(49.5,24.3) 50.1,24.9 v1(50.1,29.4)
LED_RED: length 3.9
  Top Layer w0.364: U1.20 54.2,22.93 54.8,23.53 54.8,25.35 R20.1
NRST: length 36.1
  Top Layer w0.364: 48.15,2.7 45.64,2.7 C12.1 45.62,4.22 44.04,5.8 40.7,5.8 ; 48.15,2.7 SW2.1 ; 48.15,2.7 48.15,8.6 ; 47.23,20.98 v1(42.2,20.98) ; v1(40.7,8.1) 40.7,6.1
  Bottom Layer w0.364: v1(42.2,20.98) 40.7,19.48 v1(40.7,8.1)
OSC_IN: length 11
  Top Layer w0.364: X1.1 40.45,24.05 40.9,23.6 40.9,20.93 41.5,20.33 U1.5
OSC_OUT: length 11.2
  Top Layer w0.364: 47.23,19.68 39.78,19.68 X1.3
SPI_CS: length 5.7
  Top Layer w0.364: R9.1 50.2,14.4 C1.2 47.23,14.43 U1.10
SPI_CS_PIN: length 38.1
  Top Layer w0.364: v1(70.9,9.8) 74.8,9.8 76.2,11.2 76.2,13.73 U4.5 ; 53.2,12.4 R13.1 ; 53.2,12.4 53.2,11.6 v1(54.1,10.7) ; 53.2,12.4 R9.2 ; v1(62.5,9.8) 59,9.8 v1(58,10.8)
  Bottom Layer w0.364: v1(58,10.8) 54.2,10.8 v1(54.1,10.7) ; v1(70.9,9.8) v1(62.5,9.8)
SPI_MISO: length 21.2
  Top Layer w0.364: 62.82,31.4 59.9,31.4 59.3,30.8 59.3,23.78 56.5,20.98 52.97,20.98 ; 62.82,31.4 62.8,31.42 R12.1 ; 62.82,31.4 C4.2
SPI_MISO_PIN: length 20.1
  Top Layer w0.364: v1(68.3,32.8) 67.3,33.8 R16.1 R12.2
  Bottom Layer w0.364: U4.8 80.3,26.55 74.05,32.8 v1(68.3,32.8)
SPI_MOSI: length 16.4
  Top Layer w0.364: U1.16 58.22,20.33 60.2,22.3 60.4,22.3 60.4,24.6 61.1,25.3 62.8,25.3 C3.2 62.83,25.47 R11.1
SPI_MOSI_PIN: length 18.7
  Top Layer w0.364: R11.2 67.28,28.42 R15.1 67.3,27.9 v1(68.3,26.9)
  Bottom Layer w0.364: v1(68.3,26.9) 73.7,26.9 76.6,24 81.39,24 U4.7
SPI_SCK: length 12.9
  Top Layer w0.364: 52.97,19.68 62.53,19.68 C2.2 62.83,19.43 R10.1
SPI_SCK_PIN: length 17.8
  Top Layer w0.364: v1(68.3,20.9) 67.28,21.92 R14.1 67.22,22.38 R10.2
  Bottom Layer w0.364: U4.6 80.89,21.47 80.32,20.9 v1(68.3,20.9)
SWCLK: length 25.5
  Top Layer w0.364: H1.2 48.73,34.07 50.2,32.6 57.5,32.6 58.1,32 58.1,24.33 55.4,21.62 U1.18
SWDIO: length 29.8
  Top Layer w0.364: U1.8 v1(44.5,18.38)
  Bottom Layer w0.364: v1(44.5,18.38) 44.5,18.4 43.3,19.6 43.3,32.9 44,33.6 52.9,33.6 53.81,34.51 H1.4
SWITCH_BIT0: length 21.7
  Top Layer w0.364: v1(57.3,17.3) 57.28,17.3 56.2,18.38 U1.13
  Bottom Layer w0.364: SW1.4 60.66,3.33 58.7,5.29 58.7,15.9 v1(57.3,17.3)
SWITCH_BIT1: length 20
  Top Layer w0.364: v1(59.9,17.3) 59.9,17.33 58.2,19.03 U1.14
  Bottom Layer w0.364: SW1.3 60.6,7.46 60.6,16.6 v1(59.9,17.3)
UART0_RX: length 11
  Top Layer w0.364: R2.1 39.3,27.79 45.46,21.62 U1.3
UART0_RX_PIN: length 101
  Top Layer w0.364: R2.2 R4.2 v1(34,26.6) ; U4.2 83.7,13.61 v1(83.7,37.7)
  Bottom Layer w0.364: v1(34,26.6) 34,26.1 33.5,25.6 31.2,25.6 30.4,26.4 30.4,35.8 32.9,38.3 83.1,38.3 v1(83.7,37.7)
UART0_TX: length 13
  Top Layer w0.364: R1.1 40.6,29.87 40.6,27.5 45.82,22.28 U1.2
UART0_TX_PIN: length 88.4
  Top Layer w0.364: R1.2 37.27,31.2 R3.1 v1(34,33.4)
  Bottom Layer w0.364: v1(34,33.4) 34,36.4 34.7,37.1 83.2,37.1 84.7,35.6 84.7,12.07 U4.1
$1N2907: length 7.1
  Top Layer w1: LED4.1 32.1,8.75 R21.1
$1N5214: length 5.6
  Top Layer w0.364: R18.2 52.8,31.1 LED1.2
$1N5236: length 5.6
  Top Layer w0.364: R20.2 52.57,25.12 LED3.2
$1N5790: length 5.6
  Top Layer w0.364: LED2.2 52.68,28.2 R19.2
$1N14977: length 35
  Top Layer w1: U5.3 25.03,15.27 C11.2 16.87,7.13 C6.2 16.76,7.24 U3.4 U3.2

## Copper pours and planes (outline as drawn; the poured copper is in the pictures)
GND on Top Layer: 0,40 85.4,40 85.4,0 0,0
GND on Bottom Layer: 0,40 85.4,40 85.4,0 0,0

## Text on the board
Top Silkscreen Layer: GREEN | BLUE | RED | VDD | PWR | --> | SWCLK | GND | SWDIO | MISO | MOSI | SCK | CS | SCL | SDA | RX | TX | 7V | RESET | BIT0 | BIT1 | LOW | HIGH | EFT Test Board_2 | 阻容降压 | LDO
